# EAGLE design schemat (EAGLE 7.5.0)
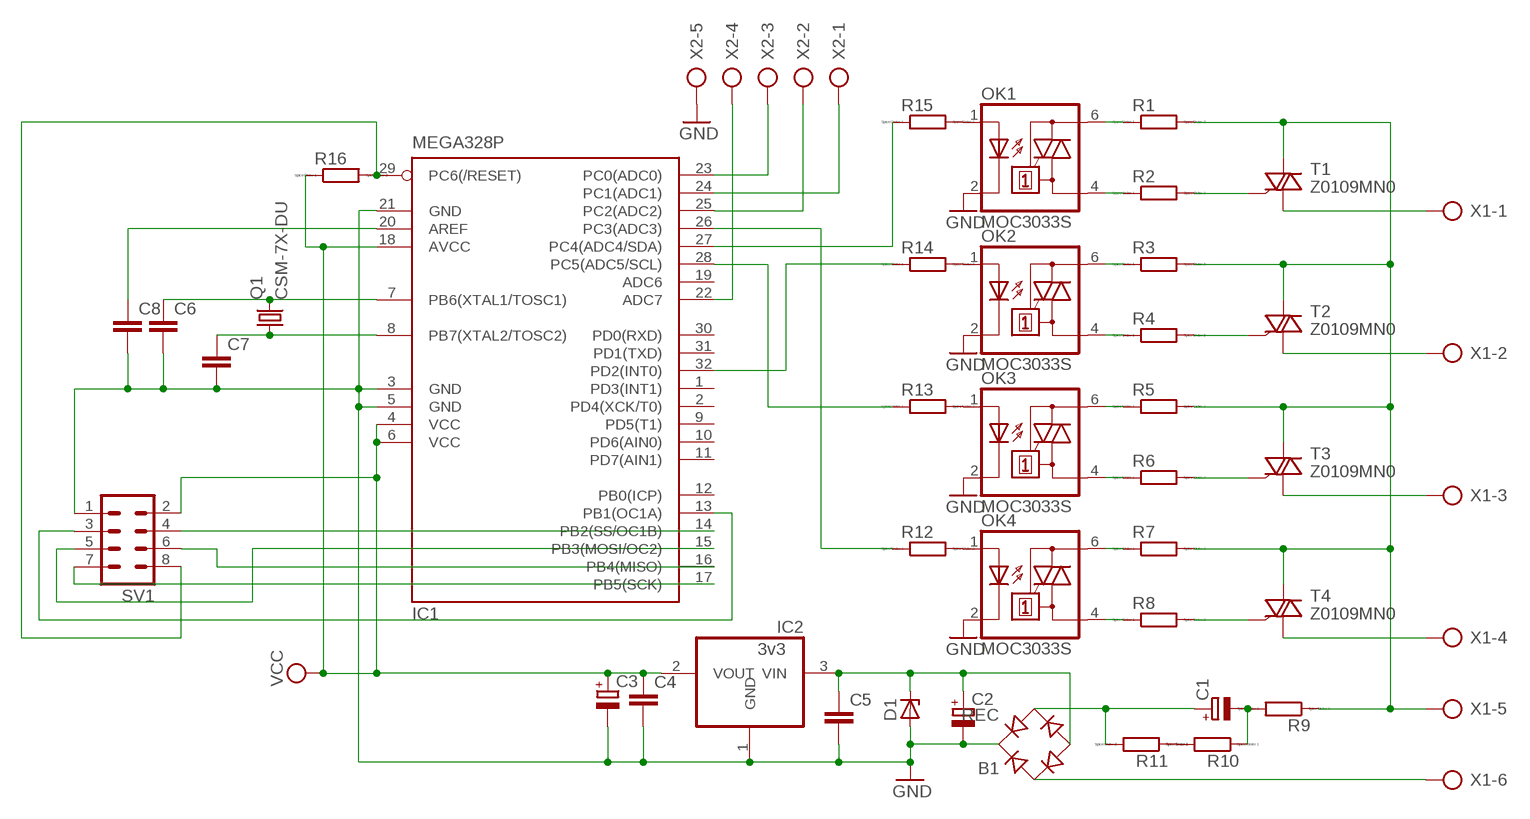
[diagram p0: schematic, sheet 1]

## Parts
B1  REC  RECTIFIER-B40S  [B40S]
C1  CPOL-EU139CLL-2W  [139CLL-2W]
C2  CPOL-EU140CLH-1010  [140CLH-1010]
C3  CPOL-EU140CLH-1010  [140CLH-1010]
C4  C-EUC1210  [C1210]
C5  C-EUC1210  [C1210]
C6  C-EUC1210  [C1210]
C7  C-EUC1210  [C1210]
C8  C-EUC1210  [C1210]
D1  ZENER-DIODESMB  [SMB]
IC1  MEGA328P  MEGA8-AI  [TQFP32-08]
IC2  3v3  REG1117  [SOT223]
OK1  MOC3033S  [DIL6-SMD]
OK2  MOC3033S  [DIL6-SMD]
OK3  MOC3033S  [DIL6-SMD]
OK4  MOC3033S  [DIL6-SMD]
Q1  CSM-7X-DU  [CSM-7X-DU]
R1  RR1206  [R1206]
R2  RR1206  [R1206]
R3  RR1206  [R1206]
R4  RR1206  [R1206]
R5  RR1206  [R1206]
R6  RR1206  [R1206]
R7  RR1206  [R1206]
R8  RR1206  [R1206]
R9  RR2512  [R2512]
R10  RR1210  [R1210]
R11  RR1210  [R1210]
R12  RR1206  [R1206]
R13  RR1206  [R1206]
R14  RR1206  [R1206]
R15  RR1206  [R1206]
R16  RR1206  [R1206]
SV1  MA04-2  [MA04-2]
T1  Z0109MN0  [SOT223]
T2  Z0109MN0  [SOT223]
T3  Z0109MN0  [SOT223]
T4  Z0109MN0  [SOT223]
X1  AK500/6  [AK500/6]
X2  AK300/5  [AK300/5]

## Nets
GND: B1.+ C2.- C3.- C4.2 C5.2 C6.2 C7.2 C8.2 D1.A IC1.3(GND) IC1.5(GND) IC1.21(GND) IC2.1(GND) OK1.2(C) OK2.2(C) OK3.2(C) OK4.2(C) SV1.1 X2.5
N$1: IC1.24(PC1(ADC1)) X2.1
N$2: R2.2 T1.3(G)
N$3: OK1.6(A2) R1.1
N$4: OK1.4(A1) R2.1
N$5: OK2.6(A2) R3.1
N$6: OK2.4(A1) R4.1
N$7: OK3.6(A2) R5.1
N$8: OK3.4(A1) R6.1
N$9: OK4.6(A2) R7.1
N$10: OK4.4(A1) R8.1
N$11: R8.2 T4.3(G)
N$12: IC1.23(PC0(ADC0)) X2.3
N$13: R6.2 T3.3(G)
N$15: R4.2 T2.3(G)
N$16: R1.2 R3.2 R5.2 R7.2 R9.1 T1.1(LD) T2.1(LD) T3.1(LD) T4.1(LD) X1.5
N$17: IC1.32(PD2(INT0)) R14.1
N$18: R10.2 R11.1
N$19: C1.- R9.2 R10.1
N$20: B1.AC2 C1.+ R11.2
N$21: B1.AC1 X1.6
N$22: B1.- C2.+ C5.1 D1.C IC2.3(VIN)
N$23: T4.2(CM) T4.4(CM) X1.4
N$24: T3.2(CM) T3.4(CM) X1.3
N$25: OK4.1(A) R12.2
N$26: OK3.1(A) R13.2
N$27: OK2.1(A) R14.2
N$28: OK1.1(A) R15.2
N$29: C6.1 IC1.7(PB6(XTAL1/TOSC1)) Q1.2
N$30: C7.1 IC1.8(PB7(XTAL2/TOSC2)) Q1.1
N$31: T2.2(CM) T2.4(CM) X1.2
N$32: IC1.26(PC3(ADC3)) R12.1
N$33: IC1.28(PC5(ADC5/SCL)) R13.1
N$34: IC1.13(PB1(OC1A)) SV1.3
N$35: IC1.27(PC4(ADC4/SDA)) R15.1
N$37: IC1.25(PC2(ADC2)) X2.2
N$39: IC1.22(ADC7) X2.4
N$40: C8.1 IC1.20(AREF)
N$41: T1.2(CM) T1.4(CM) X1.1
N$42: IC1.14(PB2(SS/OC1B)) SV1.4
N$43: IC1.15(PB3(MOSI/OC2)) SV1.5
N$44: IC1.16(PB4(MISO)) SV1.6
N$45: IC1.17(PB5(SCK)) SV1.7
N$49: IC1.29(PC6(/RESET)) R16.2 SV1.8
VCC: C3.+ C4.1 IC1.4(VCC) IC1.6(VCC) IC1.18(AVCC) IC2.2(VOUT) R16.1 SV1.2
Unconnected: IC1.1(PD3(INT1)) IC1.2(PD4(XCK/T0)) IC1.9(PD5(T1)) IC1.10(PD6(AIN0)) IC1.11(PD7(AIN1)) IC1.12(PB0(ICP)) IC1.19(ADC6) IC1.30(PD0(RXD)) IC1.31(PD1(TXD))

## Library data of the parts
B1 = rectifier:RECTIFIER-: Rectifier
C1-C3 = rcl:CPOL-EU: POLARIZED CAPACITOR, European symbol
C4-C8 = resistor:C-EU: CAPACITOR, European symbol
D1 = diode:ZENER-DIODE: Z-Diode
IC1 = atmel:MEGA8: MICROCONTROLLER 8 Kbytes FLASH, 1 kbytes SRAM, 512 bytes EEPROM, USART, 6-channel 10 bit ADC, 2-channel 8 bit ADC Pin compatible with Atmega48, ATMega88, ATMega168 Source: avr.lbr; MPN: ATMEGA8-16AU; OC_FARNELL: 9171371; OC_NEWARK: 73M8863
IC2 = burr-brown:REG1117: 800mA and 1A Low Dropout (LDO) Positive Regulator 1.8V, 2.5V, 2.85V, 3.3V, 5V, and Adj; MPN: REG1117; OC_FARNELL: 1097566; OC_NEWARK: 14P6981
OK1-OK4 = optocoupler:MOC30*: 6-Pin DIP Zero-Cross Optoisolators Triac Driver Output (250/400 Volt Peak) Source: Data sheet <http://www.fairchildsemi.com/ds/MO/MOC3031M.pdf> The old path of data sheet not more available 2013-05-06.; MF: FAIRCHILD SEMICONDUCTOR; MPN: MOC3033S-M; OC_FARNELL: unknown; OC_NEWARK: 05C2878
Q1 = crystal:CSM-7X-DU: SMD CRYSTAL Source: www.ecsxtal.com .. Crystal 3.6864MHz CSM_7X_DU.PDF; OC_FARNELL: unknown; OC_NEWARK: unknown
R1-R16 = eagle-ltspice:R: RESISTOR, European symbol; SPICEMODEL: NONE; SPICEPREFIX: R
SV1 = con-lstb:MA04-2: PIN HEADER; OC_FARNELL: unknown; OC_NEWARK: unknown
T1-T4 = nxp_60_1_1:Z0109MN0: 4Q Triac Planar passivated sensitive gate four quadrant triac in a SOT223 (SC-73) surface-mountable plastic package intended for applications requiring enhanced immunity to noise and direct interfacing to logic level ICs and low power gate drivers. AAL Eindhoven MK; 12NC: 9340 650 56135
X1 = con-ptr500:AK500/6: CONNECTOR; OC_FARNELL: unknown; OC_NEWARK: unknown
X2 = con-ptr500:AK300/5: CONNECTOR; OC_FARNELL: unknown; OC_NEWARK: unknown

## Board
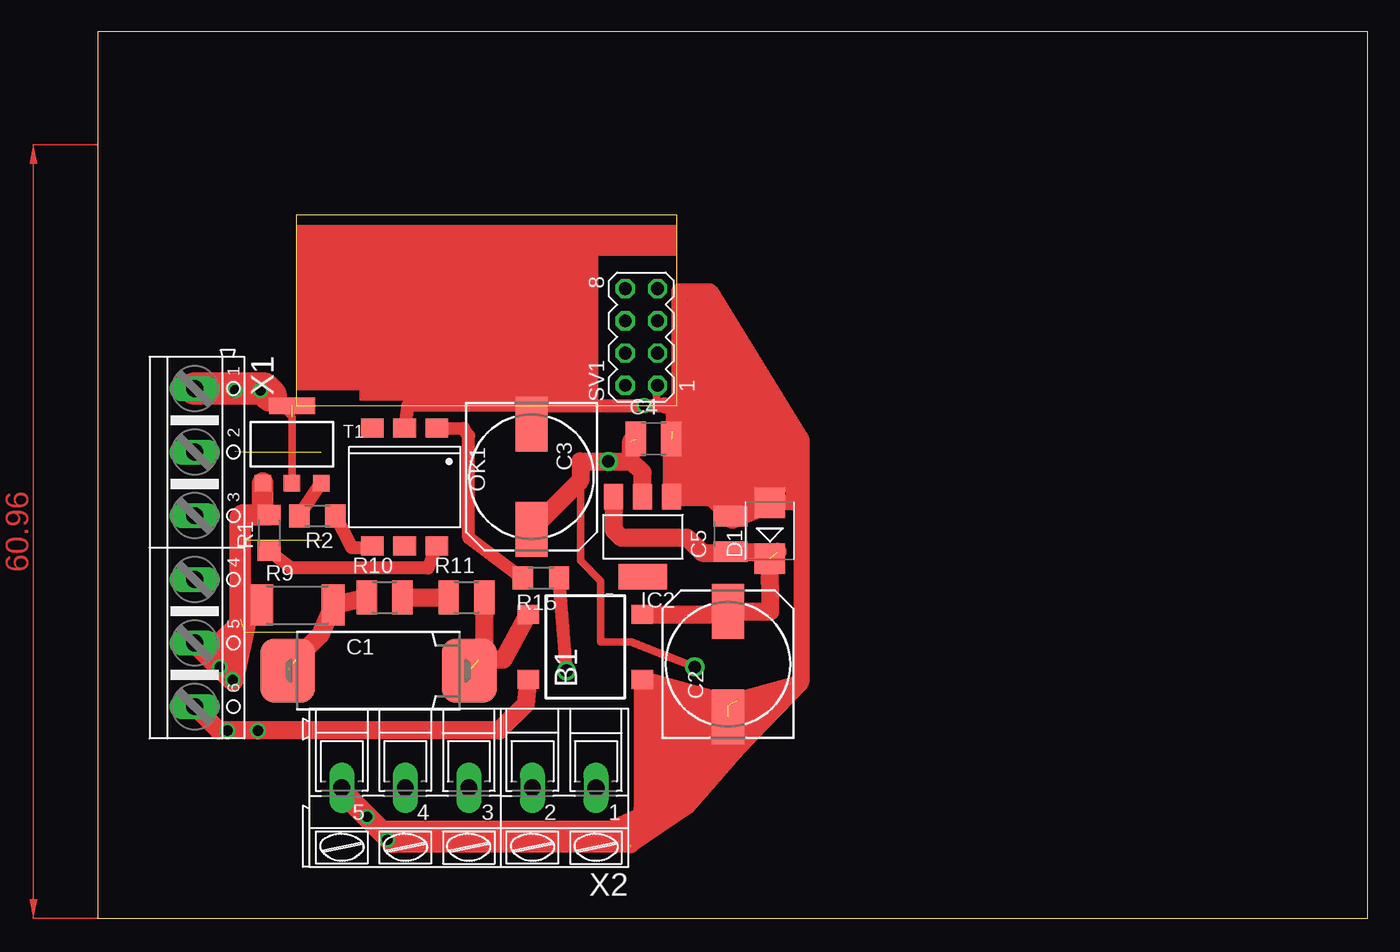
[diagram p1: board, top side]
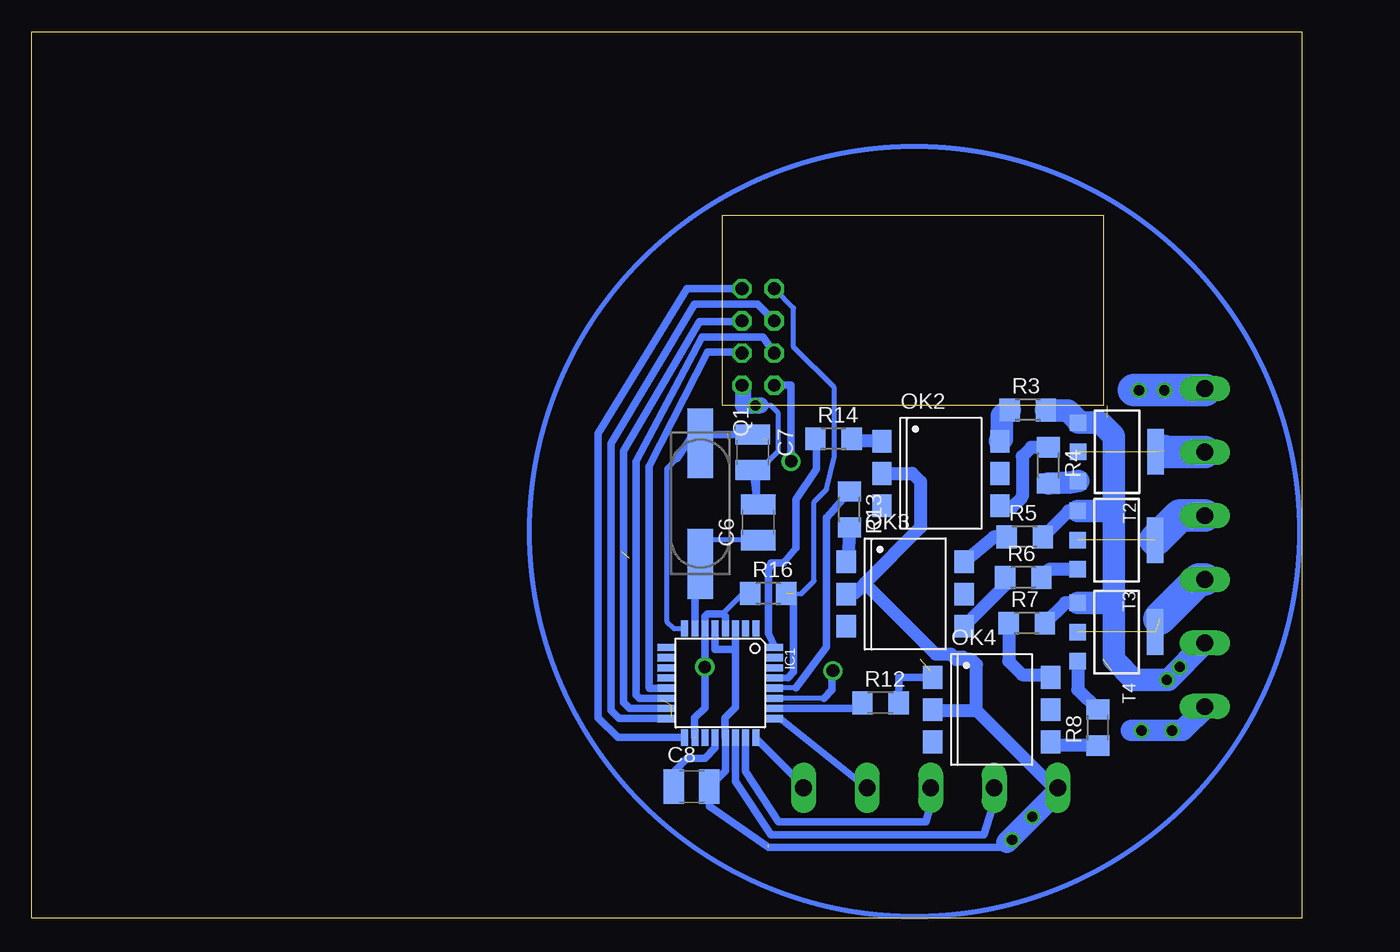
[diagram p2: board, bottom side, seen from below]

Size 100 x 69.84 mm. Coordinates in mm from the lower left corner, seen from the top.
Outline: 0,0 100,0 100,69.84 0,69.84 0,0
Copper layers (1*16): Top 0.035mm / dielectric 1.5mm / Bottom 0.035mm
Design rules "default": minimum track width 10mil, minimum drill 24mil, track to track 8mil, track to pad 8mil, pad to pad 8mil, via to via 8mil, smd to smd 8mil, copper to edge 40mil, drill to drill 8mil, minimum pad ring 10mil, minimum via ring 8mil, stop-mask expansion 4mil, vias tented up to drill 0mil, thermal gap 10mil

### Footprints (pad centres in the part's own frame; a part is rotated, then mirrored left to right if it is on the bottom)
B40S = smd 1.5 x 1.7: + -2.55,-4.5; - 2.55,-4.5; AC1 -2.55,4.5; AC2 2.55,4.5
139CLL-2W = smd 4.3 x 5: + 7.15,0; - -7.15,0
140CLH-1010 = smd 4.3 x 2.5: + 4.15,0; - -4.15,0
C1210 = smd 1.6 x 2.7: 1 -1.4,0; 2 1.4,0
SMB = smd 2.4 x 2.4: A 2.2,0; C -2.2,0
TQFP32-08 = smd 1.27 x 0.559: 1 -4.293,2.8; 2 -4.293,2; 3 -4.293,1.2; 4 -4.293,0.4; 5 -4.293,-0.4; 6 -4.293,-1.2; 7 -4.293,-2; 8 -4.293,-2.8; 17 4.293,-2.8; 18 4.293,-2; 19 4.293,-1.2; 20 4.293,-0.4; 21 4.293,0.4; 22 4.293,1.2; 23 4.293,2; 24 4.293,2.8 | smd 0.559 x 1.27: 9 -2.8,-4.293; 10 -2,-4.293; 11 -1.2,-4.293; 12 -0.4,-4.293; 13 0.4,-4.293; 14 1.2,-4.293; 15 2,-4.293; 16 2.8,-4.293; 25 2.8,4.293; 26 2,4.293; 27 1.2,4.293; 28 0.4,4.293; 29 -0.4,4.293; 30 -1.2,4.293; 31 -2,4.293; 32 -2.8,4.293
SOT223 = smd 1.499 x 2.007: 1 -2.261,-3.15; 2 0.025,-3.15; 3 2.311,-3.15 | smd 3.81 x 2.007: 4 0,3.15
DIL6-SMD = smd 1.78 x 1.52: 1 -2.54,-4.645; 2 0,-4.645; 3 2.54,-4.645; 4 2.54,4.645; 5 0,4.645; 6 -2.54,4.645
CSM-7X-DU = smd 5.5 x 2: 1 -4.75,0; 2 4.75,0
R1206 = smd 1.6 x 1.803: 1 -1.422,0; 2 1.422,0
R2512 = smd 1.8 x 3.2: 1 -2.8,0; 2 2.8,0
R1210 = smd 1.6 x 2.7: 1 -1.4,0; 2 1.4,0
MA04-2 = drill 1.016 octagon: 1 -3.81,-1.27; 2 -3.81,1.27; 3 -1.27,-1.27; 4 -1.27,1.27; 5 1.27,-1.27; 6 1.27,1.27; 7 3.81,-1.27; 8 3.81,1.27
SOT223' = smd 1.3 x 1.3: 1 -2.3,-3.05; 2 0,-3.05; 3 2.3,-3.05 | smd 3.6 x 1.3: 4 0,3.05
AK500/6 = drill 1.321 long: 1 -12.522,0; 2 -7.518,0; 3 -2.515,0; 4 2.515,0; 5 7.518,0; 6 12.522,0
AK300/5 = drill 1.321 long: 1 -10.008,0; 2 -5.004,0; 3 0,0; 4 5.004,0; 5 10.008,0

### Placement (x,y rotation side)
B1  38.38,21.39 90 top
C1  22.09,19.51 0 top
C2  49.62,20.03 90 top
C3  34.14,34.79 270 top
C4  43.76,37.78 0 top
C5  49.82,30.28 90 top
C6  42.78,31.2 90 bottom
C7  43.22,36.72 270 bottom
C8  48.04,10.38 0 bottom
D1  52.91,30.54 90 top
IC1  45.78,18.54 270 bottom
IC2  42.92,30.05 180 top
OK1  24.15,33.99 180 top
OK2  28.41,35.05 270 bottom
OK3  31.21,25.55 270 bottom
OK4  24.41,16.45 270 bottom
Q1  47.35,32.68 270 bottom
R1  13.49,30.36 90 top
R2  17.28,31.71 180 top
R3  21.56,40.06 0 bottom
R4  19.94,35.68 270 bottom
R5  21.8,30.06 0 bottom
R6  21.92,26.86 0 bottom
R7  21.64,23.26 0 bottom
R8  16.06,15.04 90 bottom
R9  15.72,24.69 0 top
R10  22.57,25.29 0 top
R11  29.02,25.29 0 top
R12  33.16,16.98 0 bottom
R13  35.62,32.21 270 bottom
R14  36.86,37.78 0 bottom
R15  34.89,26.82 180 top
R16  42,25.6 0 bottom
SV1  42.8,45.8 90 top
T1  Z0109MN0  [SOT223']  15.29,37.34 0 top
T2  Z0109MN0  [SOT223']  14.54,36.75 270 bottom
T3  Z0109MN0  [SOT223']  14.57,29.8 270 bottom
T4  Z0109MN0  [SOT223']  14.57,22.56 270 bottom
X1  7.62,29.21 270 top
X2  29.21,10.29 180 top

### Tracks (layer width: path | path; a pad name or v marks a point on that pad's centre or on a via)
GND  (via drill 0.8)  (4 unrouted)
  Top 0.61: 44.8,9.2 45,9.2 | SV1.1 44,41.92 44,40.4
  Top 1.016: 45.2,38.4 45.2,40 44.8,40.4 44.6,40.4 44,40.4 v43,40.4 35.2,40.4 34.14,39.34 C3.- 34,40.4 24.4,40.4 OK1.2 | X2.5 19.2,10.4 22,7.2 40.4,7.2 44.8,9.2 49.6,14
  Top 1.27: 44.6,40.4 45.4,40.4 45.8,40.8 45.8,49.4 48.2,49.4 55.2,38 55.4,37.8 55.4,32.8 | 53.6,32.8 55.4,32.8 | 55.4,32.8 55.4,32.2 | 55.4,32.2 55.4,18.6 | 55.4,18.6 50.4,17.2 50.4,13.4 | 23,6.4 23.2,6.2 40.8,6.2 46,8.8 50.4,13.4 | 50.4,13.4 46.4,8.8 42,5.8 23.2,5.8 | 50.4,13.4 55.4,18.6 | 55.4,18.6 51,16 51,15 53.4,16.6 | 55.4,32.2 54.8,33.6 54.4,37.4 47.8,48.2 46.8,48.2 46.6,40.2 46.2,39.6 46.4,34.2 49,34.2 50.2,33 51.6,33.8 49.4,34.2 54.2,34.2
  Top 1.422: B1.+ 49.36,17.04 49.6,16.8 | C5.2 48.3,33.2 IC2.1 45.16,33.22 C4.2
  Top 1.676: C5.2 49.96,31.54 D1.A
  Bottom 0.406: 42.82,32.44 42.82,35.38 42.8,35.4 42.6,35.4 41.2,36.8 41.2,39.8 41.8,40.4 v43,40.4
  Bottom 0.61: X2.5 23.69,5.6 42,5.6 46.64,8.84 C8.2 45.38,11.64 IC1.21 45.4,14.27 45.4,15.8 44.58,16.62 IC1.3 | IC1.3 44.58,21.22 44.6,21.2 46.2,21.2 46.2,22.81 IC1.5 | 44.6,22.85 IC1.3 | C7.2 42.82,32.44 C6.2 | OK3.2 35.25,25.55 34.4,26.4 34.2,26.4 28.6,20.8 26.6,20.8 25.4,19.6
  Bottom 1.016: OK2.2 30.65,35.05 30,34.4 30,30.8 34.4,26.4 | 34.4,26.4 35.2,25.6 35.6,25.6 OK3.2 | OK4.2 28.85,16.45 28.8,16.4 25.6,16.4 | 25.6,16.4 25.6,20 26,20.4 27.2,20.4 27.6,20.8 28.6,20.8 28.8,20.8 34.4,26.4 | X2.5 19.49,10.29 25.6,16.4
  Bottom 1.27: 44,42 44,40.4 v43,40.4 42.6,40.4
N$1
  Bottom 0.61: IC1.24 42.98,14.18 39.2,10.4 39.2,10.71 X2.1
N$2
  Top 1.016: R2.2 T1.3
N$3
  Top 1.016: OK1.6 26,27.6 15.2,27.6 R1.1
N$4
  Top 1.016: OK1.4 21.6,29.2 20,29.2 R2.1
N$5
  Bottom 1.778: R3.1 23.14,40.06 23.6,39.6 23.6,37.76 OK2.6
N$6
  Bottom 1.016: R4.1 21.3,37.1 22,36.4 22,33.2 22.8,32.4 23.66,32.4 OK2.4
N$7
  Bottom 1.016: R5.1 24.2,30.06 OK3.6
N$8
  Bottom 1.016: R6.1 23.34,26.26 26.4,23.2 26.57,23.2 OK3.4
N$9
  Bottom 1.016: R7.1 23.06,20.26 22,19.2 19.98,19.2 OK4.6
N$10
  Bottom 1.016: R8.1 19.47,13.62 OK4.4
N$11
  Bottom 1.016: T4.3 17.62,18.02 R8.2
N$12
  Bottom 0.61: IC1.23 43.78,11.58 41.2,7.6 29.6,7.6 29.2,9 29.2,8.88 X2.3
N$13
  Bottom 1.016: T3.3 19.86,27.5 R6.2
N$15
  Bottom 1.778: T2.3 18.25,34.35 R4.2
N$16  (via drill 0.8)
  Top 1.422: X1.5 9.52,21.69 11.12,23.29 R9.1
  Top 1.676: T1.1 12.99,32.28 R1.2 11.38,31.78 11.2,31.6 11.2,23.37 11.12,23.29 | 7.6,21.6 7.8,21.6 v9.6,19.8 v10.6,18.8
  Bottom 1.016: T3.1 18.34,32.1 R5.2 | T4.1 18.62,24.86 R7.2
  Bottom 1.778: 14.8,32 14.8,38 15.85,39.05 T2.1 17.59,39.19 18.4,40 20.08,40 R3.2 | 14.8,32 14.8,24.8 | 14.8,24.8 14.8,20.4 13.2,18.8 v10.6,18.8 10.51,18.8 X1.5 | T3.1 14.9,32.1 14.8,32 | T4.1 14.86,24.86 14.8,24.8
N$17
  Bottom 0.61: R14.1 38.2,37.7 38.2,35.4 39.8,33 39.8,29.2 40.8,28 41.8,28 42,27.4 42,22.45 IC1.32
N$18
  Top 1.422: R10.2 R11.1
N$19  (1 unrouted)
  Top 1.422: 15.6,20.4 17.52,22.32 R9.2 R10.1
N$20  (1 unrouted)
  Top 1.422: R11.2 30.42,20.82 30,20.4 31.94,20.4 B1.AC2
N$21  (via drill 0.8)
  Top 1.422: B1.AC1 33.68,16.88 31.6,14.8 v12.6,14.8 v10.2,14.8 9.51,14.8 X1.6
  Bottom 1.676: 7.6,16.8 7.6,16.6 9.4,14.8 v10.2,14.8 v12.6,14.8 13.4,14.8
N$22  (1 unrouted)
  Top 1.422: B1.- 48.98,23.94 C2.+ 52.95,24.18 D1.C | 53.52,28.88 C5.1 49.74,28.8 47.6,28.8 46.4,30 41.2,30 40.61,30.59 IC2.3
N$23  (2 unrouted)
  Bottom 2.54: X1.4 8.11,26.7 11.2,23.6
N$24  (1 unrouted)
  Bottom 2.54: X1.3 9.6,31.73 T3.4
N$25
  Bottom 0.61: OK4.1 31.73,18.99 R12.2
N$26
  Bottom 1.016: OK3.1 35.66,28.11 R13.2
N$27
  Bottom 1.016: OK2.1 35.25,37.59 R14.2
N$28
  Top 1.016: OK1.1 28.8,38.6 29.2,38 29.2,30 33.18,27.02 R15.2
N$29
  Bottom 0.406: C6.1 47.15,29.8 | 47.4,29.8 47.15,29.8 | 47.15,29.8 Q1.2
  Bottom 0.61: IC1.7 47.78,25.9 Q1.2
N$30
  Bottom 0.406: 49.18,36.22 50,35.4 50,23.4 49.43,22.83 IC1.8
  Bottom 0.61: C7.1 46.04,38.12 47.96,38.04 | 47.96,38.04 Q1.1 | 49.18,36.22 47.96,38.04
N$31  (2 unrouted)
  Bottom 2.54: X1.2 10.73,36.73 10.8,36.8
N$32
  Bottom 0.61: IC1.26 35.06,16.54 34.8,16.8 34.6,16.96 R12.1
N$33
  Bottom 0.406: 39.8,18.16 41.47,18.16 IC1.28
  Bottom 0.61: R13.1 37.38,31.58 37.4,31.6 37.4,21.4 39.8,18.16
N$34
  Bottom 0.61: SV1.3 44.2,44.6 46.8,44.6 51.4,35.6 51.4,18.2 51.34,18.14 IC1.13
N$35  (via drill 1)
  Top 1.016: v36.91,19.51 R15.1
  Bottom 0.406: 37.6,17.35 41.48,17.35 IC1.27
  Bottom 0.61: 37.6,17.35 37,18 37,19.4 v36.91,19.51
N$37
  Bottom 0.61: IC1.25 41.06,15.74 X2.2
N$39
  Bottom 0.61: X2.4 24.4,8.7 24.4,8.6 25,6.6 41.8,6.6 44.58,10.78 IC1.22
N$40
  Bottom 0.61: IC1.20 46.18,13.42 47,12.6 48.4,12.6 49.4,11.6 49.4,10.42 C8.1
N$41  (1 unrouted)
  Top 0.61: 13.6,41.2 15.29,39.51 T1.2
  Top 2.54: X1.1 13.07,41.73 13.6,41.2
N$42
  Bottom 0.61: SV1.4 42.4,45.8 47.2,45.8 52.4,36 52.4,17.6 52.14,17.34 IC1.14
N$43
  Bottom 0.61: SV1.5 44.14,47 47.4,47 53.4,36.8 53.4,17 52.94,16.54 IC1.15
N$44
  Bottom 0.61: SV1.6 42.86,48.4 47.8,48.4 54.4,37.4 54.4,16.4 53.74,15.74 IC1.16
N$45
  Bottom 0.61: SV1.7 48.4,49.6 55.4,38.2 55.4,15.8 53.85,14.25 IC1.17
N$46  (via drill 0.8)
  Bottom 2.54: 7.6,41.6 v10.8,41.6 v12.8,41.6 13.2,41.6
N$47
  Top 1.27: 11.8,23.2 10.8,18.6 10.2,21 10.8,21.8
N$48  (via drill 0.8)
  Top 1.676: 19.2,10.2 19.2,10 v21.2,8 23.2,6
  Bottom 1.676: 19.2,10.2 19.2,10 v21.2,8 23.2,6
N$49  (1 unrouted)
  Bottom 0.406: R16.2 39.42,25.58 38.4,26.6 38.4,32.8 37.4,33.8 36.8,36.4 36.8,41.8 40,45 40,48.08 SV1.8
  Bottom 0.508: IC1.29 40.46,18.94
  Bottom 0.61: 40.46,18.94 40,19.4 40,25.6
N$50  (via drill 0.8)
  other vias: 22.8,6.2
N$53
  Top 1.422: 49.2,24.4 48.8,24 49.6,24
N$56
  Top 1.27: 42.8,18.8 42.8,8.6 48.4,13.8 43.6,10.6 43.8,17.6 48.2,16 47.8,14.6 44.4,12.4 44.8,16.4 47.4,15.2 45.2,14.2 45.6,15.2
VCC  (via drill 1)  (2 unrouted)
  Top 0.61: IC2.2 42.9,35.3 42.2,36 v40.2,36 | 38,36 38,28.2 39.6,26.6 39.6,21.8 42,21.8 v47,19.8
  Top 1.422: IC2.2 42.9,35.1 42,36 | 42,36 v40.2,36 38,36 38,34.5 C3.+ | 42,36 42,37.6
  Bottom 0.406: R16.1 44,25.6 45.6,24
  Bottom 0.61: IC1.4 45.38,23.78 45.6,24 46.8,24 47,23.8 47,22.85 | 47.8,14.27 47.8,15.8 47,16.6 v47,19.8 47,22.85 | 47,22.85 IC1.6 | SV1.2 40.2,42 v40.2,36
(copper drawn outside any net)
  shapes: Bottom circle x1, Top area x11